# EAGLE board 320349C(Rev1)E7 (EAGLE 7.7.0), part 1 of 3
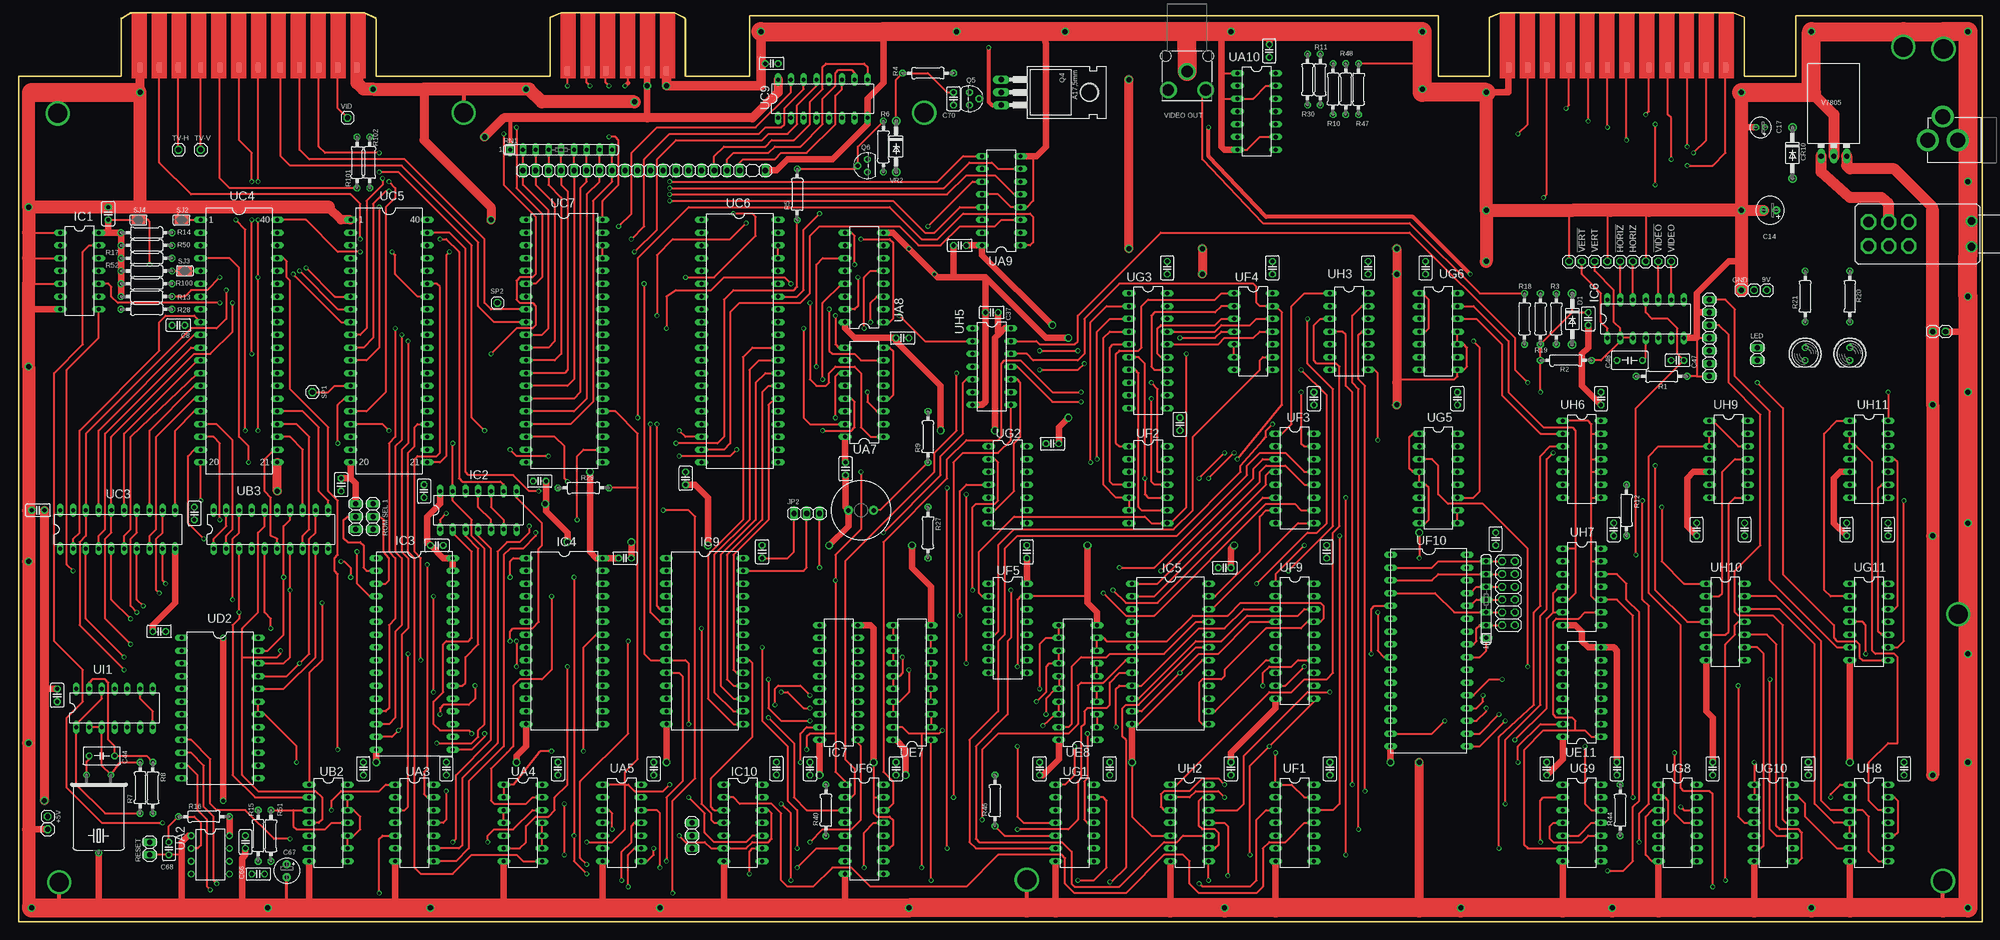
[diagram p9: board, top side]
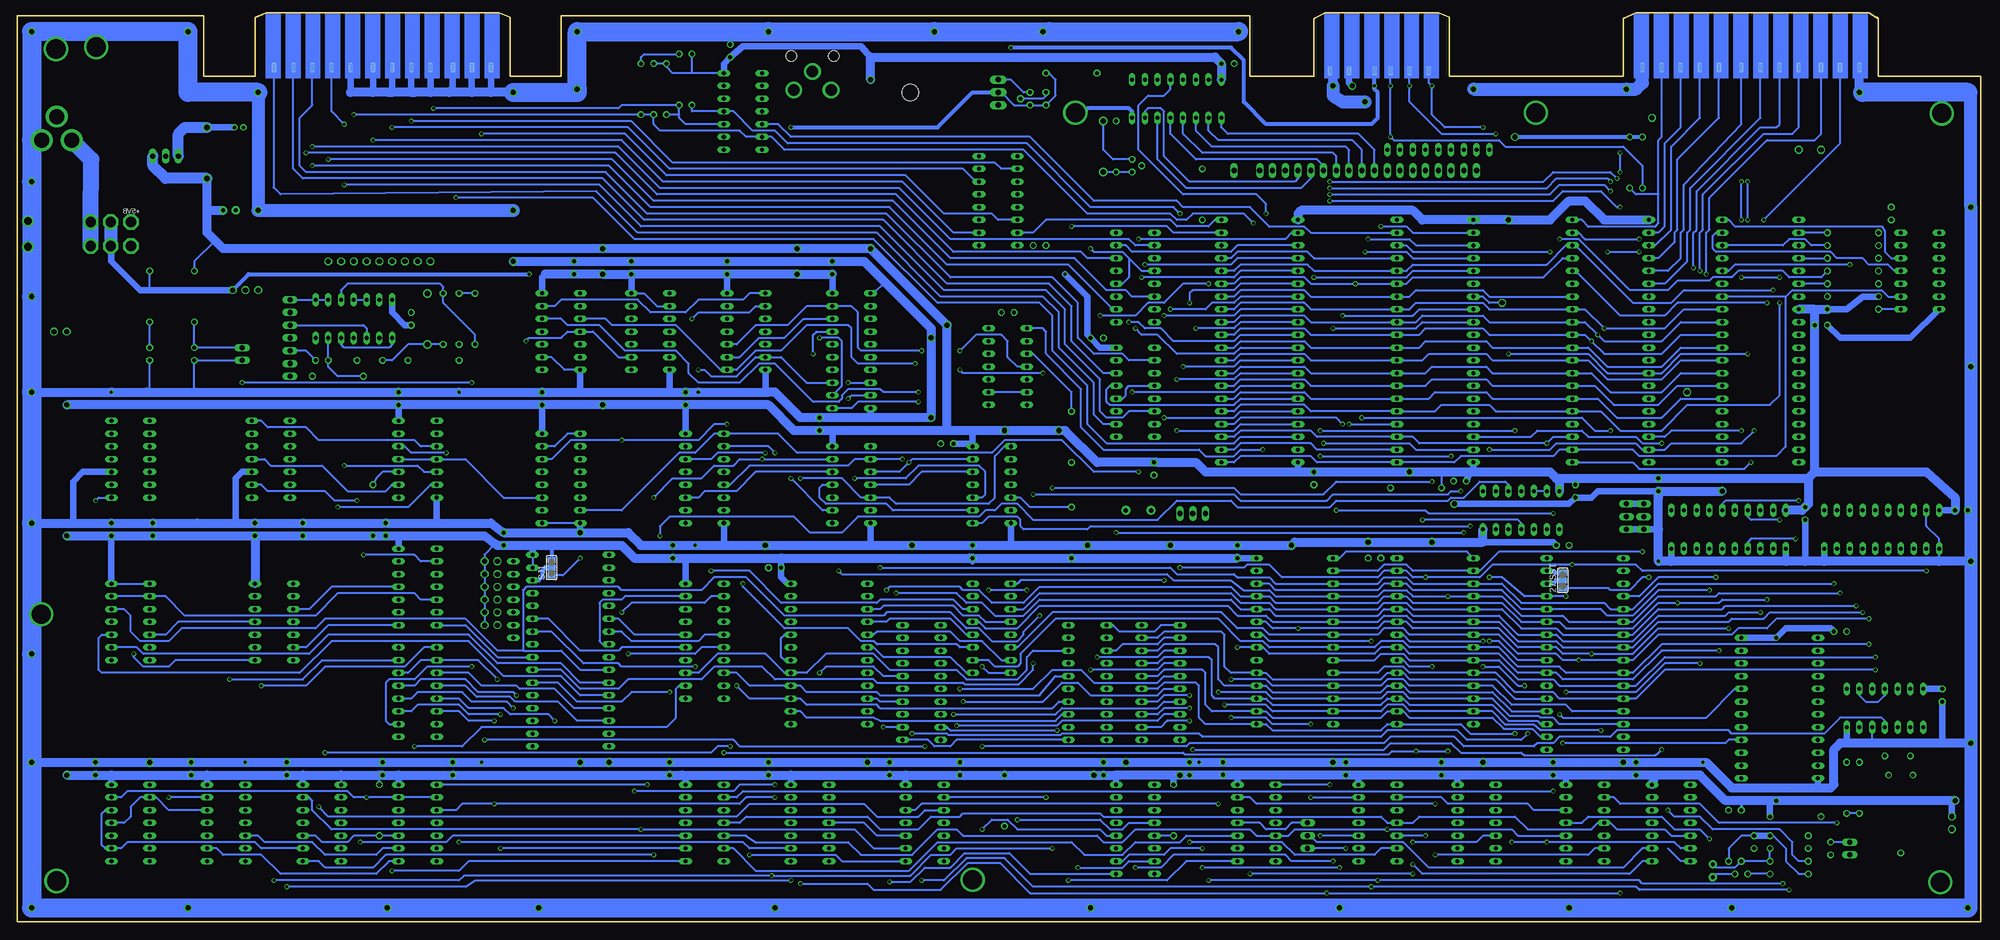
[diagram p10: board, bottom side, seen from below]

Size 390.91 x 180.98 mm. Coordinates in mm from the lower left corner, seen from the top.
Outline: 0,0 0,168.28 20.32,168.28 20.32,179.71 22.23,180.97 68.58,180.97 71.12,179.71 71.12,168.28 105.73,168.28 105.73,180.02 107.95,180.97 130.49,180.97 132.72,179.71 132.72,168.28 145.41,168.28 145.41,180.34 282.57,180.34 282.57,168.28 292.74,168.28 292.74,180.02 294.96,180.97 341.31,180.97 343.54,180.02 343.54,168.28 353.69,168.28 353.69,180.34 390.91,180.34 390.91,0 0,0
Copper layers (1*16): Top 0.035mm / dielectric 1.5mm / Bottom 0.035mm
Design rules "Kens Modified_SeeedStudio_2layer_DRU_no_angle": minimum track width 6mil, minimum drill 12mil, track to track 10mil, track to pad 10mil, pad to pad 10mil, via to via 10mil, smd to smd 0mil, copper to edge 10mil, drill to drill 10mil, minimum pad ring 10mil, minimum via ring 6mil, stop-mask expansion 2mil, vias tented up to drill 100mil, thermal gap 20mil
tKeepout: area 177.6,158.4 to 182.8,163.7; area 85.9,158.4 to 91.1,163.7; area 380.5,171.1 to 385.8,176.4; area 380.4,5.5 to 385.7,10.7; area 198,5.8 to 203.3,11; area 5.4,5.3 to 10.6,10.5; area 5.1,158.3 to 10.4,163.5

## Footprints (pad centres in the part's own frame; a part is rotated, then mirrored left to right if it is on the bottom)
1X01 = drill 1.016 octagon: 1 0,0
SJ_2 = smd 1.168 x 1.6: 1 -1.524,0; 2 0,0; 3 1.524,0
C025-025X050 = drill 0.813 octagon: 1 -1.27,0; 2 1.27,0
E2,5-6 = drill 0.813 pad 1.6: + -1.27,0 | drill 0.813 pad 1.6 octagon: - 1.27,0
E1,8-4 = drill 0.711 pad 1.168: + -0.889,0 | drill 0.711 pad 1.168 octagon: - 0.889,0
C050-035X075 = drill 0.813 octagon: 1 -2.54,0; 2 2.54,0
E2,5-5 = drill 0.813 pad 1.6: + -1.27,0 | drill 0.813 pad 1.6 octagon: - 1.27,0
DO41-10 = drill 1.118: A 5.08,0; C -5.08,0
DIL14 = drill 0.813 long: 1 -7.62,-3.81; 2 -5.08,-3.81; 3 -2.54,-3.81; 4 0,-3.81; 5 2.54,-3.81; 6 5.08,-3.81; 7 7.62,-3.81; 8 7.62,3.81; 9 5.08,3.81; 10 2.54,3.81; 11 0,3.81; 12 -2.54,3.81; 13 -5.08,3.81; 14 -7.62,3.81
SST39SF010A = drill 0.8 long: 1 -7.62,17.78; 2 -7.62,15.24; 3 -7.62,12.7; 4 -7.62,10.16; 5 -7.62,7.62; 6 -7.62,5.08; 7 -7.62,2.54; 8 -7.62,0; 9 -7.62,-2.54; 10 -7.62,-5.08; 11 -7.62,-7.62; 12 -7.62,-10.16; 13 -7.62,-12.7; 14 -7.62,-15.24; 15 -7.62,-17.78; 16 -7.62,-20.32; 17 7.62,-20.32; 18 7.62,-17.78; 19 7.62,-15.24; 20 7.62,-12.7; 21 7.62,-10.16; 22 7.62,-7.62; 23 7.62,-5.08; 24 7.62,-2.54; 25 7.62,0; 26 7.62,2.54; 27 7.62,5.08; 28 7.62,7.62; 29 7.62,10.16; 30 7.62,12.7; 31 7.62,15.24; 32 7.62,17.78
DIL28 = drill 0.813 long: 1 -16.51,-7.62; 2 -13.97,-7.62; 3 -11.43,-7.62; 4 -8.89,-7.62; 5 -6.35,-7.62; 6 -3.81,-7.62; 7 -1.27,-7.62; 8 1.27,-7.62; 9 3.81,-7.62; 10 6.35,-7.62; 11 8.89,-7.62; 12 11.43,-7.62; 13 13.97,-7.62; 14 16.51,-7.62; 15 16.51,7.62; 16 13.97,7.62; 17 11.43,7.62; 18 8.89,7.62; 19 6.35,7.62; 20 3.81,7.62; 21 1.27,7.62; 22 -1.27,7.62; 23 -3.81,7.62; 24 -6.35,7.62; 25 -8.89,7.62; 26 -11.43,7.62; 27 -13.97,7.62; 28 -16.51,7.62
DIL24 = drill 0.813 long: 1 -13.97,-7.62; 2 -11.43,-7.62; 3 -8.89,-7.62; 4 -6.35,-7.62; 5 -3.81,-7.62; 6 -1.27,-7.62; 7 1.27,-7.62; 8 3.81,-7.62; 9 6.35,-7.62; 10 8.89,-7.62; 11 11.43,-7.62; 12 13.97,-7.62; 13 13.97,7.62; 14 11.43,7.62; 15 8.89,7.62; 16 6.35,7.62; 17 3.81,7.62; 18 1.27,7.62; 19 -1.27,7.62; 20 -3.81,7.62; 21 -6.35,7.62; 22 -8.89,7.62; 23 -11.43,7.62; 24 -13.97,7.62
DIL20 = drill 0.813 long: 1 -11.43,-3.81; 2 -8.89,-3.81; 3 -6.35,-3.81; 4 -3.81,-3.81; 5 -1.27,-3.81; 6 1.27,-3.81; 7 3.81,-3.81; 8 6.35,-3.81; 9 8.89,-3.81; 10 11.43,-3.81; 11 11.43,3.81; 12 8.89,3.81; 13 6.35,3.81; 14 3.81,3.81; 15 1.27,3.81; 16 -1.27,3.81; 17 -3.81,3.81; 18 -6.35,3.81; 19 -8.89,3.81; 20 -11.43,3.81
UPS24EDGE = smd 0.965 x 1.93: 1 -21.59,3.81; 2 -17.78,3.81; 3 -13.97,3.81; 4 -10.16,3.81; 5 -6.35,3.81; 6 -1.905,3.81; 7 1.905,3.81; 8 5.715,3.81; 9 9.525,3.81; 10 13.97,3.81; 11 17.78,3.81; 12 21.59,3.81 | smd 0.965 x 1.93 bottom: A -21.59,3.81; B -17.78,3.81; C -13.97,3.81; D -10.16,3.81; E -6.35,3.81; F -1.905,3.81; H 1.905,3.81; J 5.715,3.81; K 9.525,3.81; L 13.97,3.81; M 17.78,3.81; N 21.59,3.81
CASSETTE = smd 0.965 x 1.93: 1 -21.59,4.445; 2 -17.78,4.445; 3 -13.97,4.445; 4 -9.525,4.445; 5 -5.715,4.445; 6 -1.905,4.445 | smd 0.965 x 1.93 bottom: A -22.225,4.445; B -18.415,4.445; C -13.335,4.445; D -10.16,4.445; E -6.35,4.445; F -2.54,4.445
POWER_JACK_PTH = drill 2.997 pad 4.318: GND 0,7.7; GNDBREAK 4.7,10.7; PWR 0,13.7
PET_KEYBOARD = drill 1.016 long: 1 -24.13,0; 2 -21.59,0; 3 -19.05,0; 4 -16.51,0; 5 -13.97,0; 6 -11.43,0; 7 -8.89,0; 8 -6.35,0; 9 -3.81,0; 10 -1.27,0; 11 1.27,0; 12 3.81,0; 13 6.35,0; 14 8.89,0; 15 11.43,0; 16 13.97,0; 17 16.51,0; 18 19.05,0; 20 24.13,0
1X03 = drill 1.016 long: 1 -2.54,0; 2 0,0; 3 2.54,0
1X07 = drill 1.016 long: 1 -7.62,0; 2 -5.08,0; 3 -2.54,0; 4 0,0; 5 2.54,0; 6 5.08,0; 7 7.62,0
2X06 = drill 1.016 octagon: 1 -6.35,-1.27; 2 -6.35,1.27; 3 -3.81,-1.27; 4 -3.81,1.27; 5 -1.27,-1.27; 6 -1.27,1.27; 7 1.27,-1.27; 8 1.27,1.27; 9 3.81,-1.27; 10 3.81,1.27; 11 6.35,-1.27; 12 6.35,1.27
1X02 = drill 1.016 long: 1 -1.27,0; 2 1.27,0
LED5MM = drill 0.813 octagon: A -1.27,0; K 1.27,0
TO220 = drill 1.118 long: 1 -2.54,-6.35; 2 0,-6.35; 3 2.54,-6.35 | hole 3.302: 0,11.176
TO92 = drill 0.813 octagon: 1 1.27,0; 2 0,1.905; 3 -1.27,0
0207/10 = drill 0.813 octagon: 1 -5.08,0; 2 5.08,0
SIL9 = drill 0.813 long: 1 -10.16,0; 2 -7.62,0; 3 -5.08,0; 4 -2.54,0; 5 0,0; 6 2.54,0; 7 5.08,0; 8 7.62,0; 9 10.16,0
SIL7 = drill 0.813 long: 1 -7.62,0; 2 -5.08,0; 3 -2.54,0; 4 0,0; 5 2.54,0; 6 5.08,0; 7 7.62,0
320-938H = drill 2.007 octagon: 1 -4.013,-2.388; 2 0,-2.388; 3 4.013,-2.388; 4 -4.013,2.388; 5 0,2.388; 6 4.013,2.388 | drill 1.5: P$1 16.51,2.54; P$2 16.51,-2.54
BUZZER-12MM = drill 0.9 pad 1.778: + 2.5,0; - -2.5,0
SJ = smd 1.168 x 1.6: 1 -0.762,0; 2 0.762,0
DIL08 = drill 0.813 pad 1.27: 1 -3.81,-3.81; 2 -1.27,-3.81; 3 1.27,-3.81; 4 3.81,-3.81; 5 3.81,3.81; 6 1.27,3.81; 7 -1.27,3.81; 8 -3.81,3.81
DIL16 = drill 0.813 long: 1 -8.89,-3.81; 2 -6.35,-3.81; 3 -3.81,-3.81; 4 -1.27,-3.81; 5 1.27,-3.81; 6 3.81,-3.81; 7 6.35,-3.81; 8 8.89,-3.81; 9 8.89,3.81; 10 6.35,3.81; 11 3.81,3.81; 12 1.27,3.81; 13 -1.27,3.81; 14 -3.81,3.81; 15 -6.35,3.81; 16 -8.89,3.81
DIP40 = drill 0.813 pad 1.27 long: 1 -24.13,-7.62; 2 -21.59,-7.62; 3 -19.05,-7.62; 4 -16.51,-7.62; 5 -13.97,-7.62; 6 -11.43,-7.62; 7 -8.89,-7.62; 8 -6.35,-7.62; 9 -3.81,-7.62; 10 -1.27,-7.62; 11 1.27,-7.62; 12 3.81,-7.62; 13 6.35,-7.62; 14 8.89,-7.62; 15 11.43,-7.62; 16 13.97,-7.62; 17 16.51,-7.62; 18 19.05,-7.62; 19 21.59,-7.62; 20 24.13,-7.62; 21 24.13,7.62; 22 21.59,7.62; 23 19.05,7.62; 24 16.51,7.62; 25 13.97,7.62; 26 11.43,7.62; 27 8.89,7.62; 28 6.35,7.62; 29 3.81,7.62; 30 1.27,7.62; 31 -1.27,7.62; 32 -3.81,7.62; 33 -6.35,7.62; 34 -8.89,7.62; 35 -11.43,7.62; 36 -13.97,7.62; 37 -16.51,7.62; 38 -19.05,7.62; 39 -21.59,7.62; 40 -24.13,7.62
DIL40 = drill 0.813 long: 1 -24.13,-7.62; 2 -21.59,-7.62; 3 -19.05,-7.62; 4 -16.51,-7.62; 5 -13.97,-7.62; 6 -11.43,-7.62; 7 -8.89,-7.62; 8 -6.35,-7.62; 9 -3.81,-7.62; 10 -1.27,-7.62; 11 1.27,-7.62; 12 3.81,-7.62; 13 6.35,-7.62; 14 8.89,-7.62; 15 11.43,-7.62; 16 13.97,-7.62; 17 16.51,-7.62; 18 19.05,-7.62; 19 21.59,-7.62; 20 24.13,-7.62; 21 24.13,7.62; 22 21.59,7.62; 23 19.05,7.62; 24 16.51,7.62; 25 13.97,7.62; 26 11.43,7.62; 27 8.89,7.62; 28 6.35,7.62; 29 3.81,7.62; 30 1.27,7.62; 31 -1.27,7.62; 32 -3.81,7.62; 33 -6.35,7.62; 34 -8.89,7.62; 35 -11.43,7.62; 36 -13.97,7.62; 37 -16.51,7.62; 38 -19.05,7.62; 39 -21.59,7.62; 40 -24.13,7.62
DIL24-6 = drill 0.813 long: 1 -13.97,-7.62; 2 -11.43,-7.62; 3 -8.89,-7.62; 4 -6.35,-7.62; 5 -3.81,-7.62; 6 -1.27,-7.62; 7 1.27,-7.62; 8 3.81,-7.62; 9 6.35,-7.62; 10 8.89,-7.62; 11 11.43,-7.62; 12 13.97,-7.62; 13 13.97,7.62; 14 11.43,7.62; 15 8.89,7.62; 16 6.35,7.62; 17 3.81,7.62; 18 1.27,7.62; 19 -1.27,7.62; 20 -3.81,7.62; 21 -6.35,7.62; 22 -8.89,7.62; 23 -11.43,7.62; 24 -13.97,7.62
VREG_78XXL = drill 1.016 long: GND 0,-3.81; IN -2.54,-3.81; OUT 2.54,-3.81
RCA = drill 2.3: BARREL 0,0; BREAK 3.7,3.7; SPRING 3.7,-3.7 | hole 2.1: -3.1,4.25; -3.1,-4.25
DO41Z10 = drill 1.118: A 5.08,0; C -5.08,0
HC49TL-H = drill 0.813: 1 -2.413,-7.62; 2 2.413,-7.62; 3 0,7.874

## Placement (x,y rotation side)
9V  [1X01]  347.98,125.73 180 top
27/SST  27/SST  [SJ_2]  83.19,67.94 90 bottom
!HORIZ  [1X01]  318.77,131.44 90 top
!VERT  [1X01]  311.15,131.44 90 top
!VIDEO  [1X01]  326.39,131.44 90 top
+5V  [1X01]  5.71,20.95 0 top
+5V1  +5V  [1X01]  381,117.47 0 top
C1  0.1uF/50  [C025-025X050]  103.65,87.73 0 top
C2  0.1uF/50  [C025-025X050]  68.58,30.48 90 top
C3  0.1uF/50  [C025-025X050]  85.09,30.48 90 top
C4  0.1uF/50  [C025-025X050]  107.31,30.48 90 top
C5  0.1uF/50  [C025-025X050]  126.36,30.48 90 top
C6  0.1uF/50  [C025-025X050]  45.09,15.88 270 top
C7  0.1uF/50  [C025-025X050]  3.81,81.92 180 top
C8  0.1uF/50  [C025-025X050]  31.75,118.75 180 top
C9  0.1uF/50  [C025-025X050]  64.14,87 270 top
C10  0.1uF/50  [C025-025X050]  314.96,104.14 90 top
C11  0.1uF/50  [C025-025X050]  203.2,30.48 90 top
C12  0.1uF/50  [C025-025X050]  231.14,99.06 90 top
C13  0.1uF/50  [C025-025X050]  372.11,78.11 90 top
C14  47uF/16  [E2,5-6]  348.62,141.6 180 top
C17  1.0uF/25  [E1,8-4]  346.71,158.12 180 top
C18  0.1uF/50  [C025-025X050]  240.03,70.48 0 top
C19  0.1uF/50  [C025-025X050]  205.74,95.17 0 top
C20  0.1uF/50  [C025-025X050]  280.04,130.18 90 top
C21  0.1uF/50  [C025-025X050]  260.99,30.48 90 top
C22  0.1uF/50  [C025-025X050]  83.19,74.93 0 top
C23  0.1uF/50  [C025-025X050]  174.62,30.48 90 top
C24  0.1uF/50  [C025-025X050]  334.01,78.11 90 top
C25  0.1uF/50  [C025-025X050]  217.17,30.48 90 top
C26  0.1uF/50  [C025-025X050]  257.81,104.14 90 top
C27  0.1uF/50  [C025-025X050]  241.3,30.48 90 top
C28  0.1uF/50  [C025-025X050]  157.48,30.48 90 top
C29  0.1uF/50  [C025-025X050]  318.13,30.48 90 top
C30  0.1uF/50  [C025-025X050]  294,76.2 90 top
C31  0.1uF/50  [C025-025X050]  147.96,73.66 90 top
C32  0.1uF/50  [C025-025X050]  260.35,73.66 90 top
C33  0.1uF/50  [C025-025X050]  343.54,78.11 90 top
C34  0.1uF/50  [C025-025X050]  120.65,72.39 0 top
C35  0.1uF/50  [C025-025X050]  363.86,78.11 90 top
C36  0.1uF/50  [C025-025X050]  337.19,30.48 90 top
C37  0.1uF/50  [C025-025X050]  193.68,121.28 180 top
C38  0.1uF/50  [C025-025X050]  150.81,30.52 90 top
C39  0.1uF/50  [C025-025X050]  249.56,130.18 90 top
C40  0.1uF/50  [C025-025X050]  375.29,30.48 90 top
C41  0.1uF/50  [C025-025X050]  228.6,130.18 90 top
C42  0.1uF/50  [C025-025X050]  200.66,73.66 90 top
C44  22pF  [C050-035X075]  16.51,33.02 180 top
C45  0.1uF/50  [C025-025X050]  268.61,130.18 90 top
C46  0.1uF/50  [C025-025X050]  286.38,104.14 90 top
C47  2200pF  [C025-025X050]  330.2,111.76 180 top
C48  47uF  [C050-035X075]  320.68,111.76 180 top
C49  0.1uF/50  [C025-025X050]  312.42,120.02 90 top
C50  0.1uF/50  [C025-025X050]  356.24,30.48 90 top
C51  0.1uF/50  [C025-025X050]  80.64,85.72 270 top
C52  0.1uF/50  [C025-025X050]  175.9,116.2 0 top
C53  0.1uF/50  [C025-025X050]  27.94,57.78 180 top
C54  0.1uF/50  [C025-025X050]  149.86,170.81 180 top
C55  0.1uF/50  [C025-025X050]  248.92,173.35 90 top
C56  0.1uF/50  [C025-025X050]  187.32,134.62 180 top
C66  0.01uF  [C025-025X050]  47.62,9.53 0 top
C67  1.0uF/25  [E2,5-5]  53.34,10.16 270 top
C68  0.1uF/50  [C025-025X050]  29.84,14.61 270 top
C70  0.01uF  [C025-025X050]  186.06,163.83 90 top
C77  0.1uF/50  [C025-025X050]  17.78,140.97 90 top
C78  0.1uF/50  [C025-025X050]  132.72,88.27 270 top
C79  0.1uF/50  [C025-025X050]  34.92,81.28 270 top
C80  0.1uF/50  [C025-025X050]  7.62,45.09 270 top
C91  0.1uF/50  [C025-025X050]  317.5,78.11 90 top
C92  0.1uF/50  [C025-025X050]  304.17,30.48 90 top
C93  0.1uF/50  [C025-025X050]  164.55,90.18 270 top
CR10  1N4001  [DO41-10]  353.06,153.03 270 top
D1  1N4001  [DO41-10]  309.25,120.02 270 top
GND2  GND  [1X01]  342.9,125.73 0 top
GND3  GND  [1X01]  383.54,117.47 0 top
GND4  GND  [1X01]  5.71,18.41 90 top
HGND  GND  [1X01]  316.23,131.44 90 top
HORIZ  [1X01]  321.31,131.44 90 top
IC1  7417  [DIL14]  12.06,129.54 270 top
IC2  7400  [DIL14]  91.44,81.92 0 top
IC3  SST39SF010A / 27512  [SST39SF010A]  78.74,54.61 0 top
IC4  62256  [DIL28]  108.58,55.88 270 top
IC5  6116  [DIL24]  229.24,53.34 270 top
IC6  74LS02N  [DIL14]  323.85,120.02 0 top
IC7  74LS645N  [DIL20]  163.19,47.62 90 top
IC9  62256  [DIL28]  136.53,55.88 270 top
IC10  74LS00N  [DIL14]  144.15,19.68 270 top
J1  IEEE-488 INTERFACE  [UPS24EDGE]  318.13,173.85 180 top
J2  USER PORT  [UPS24EDGE]  45.72,173.85 180 top
J3  CASSETTE #1  [CASSETTE]  107.31,173.85 180 top
J4  POWER_JACKPTH  [POWER_JACK_PTH]  393.7,155.57 90 top
J5  KEYBOARD SCAN  [PET_KEYBOARD]  124.46,149.54 0 top
JP1  ROM SEL 1  [1X03]  70.48,80.64 270 top
JP2  RO / RW SELECT  [1X03]  156.84,81.28 0 top
JP3  9A / 9F SELECT  [1X03]  133.99,17.14 270 top
JP4  VIDEO  [1X07]  336.55,116.2 270 top
JP5  ROM SEL 2  [1X03]  67.06,80.64 270 top
JP6  FONT SEL  [2X06]  296.55,65.41 90 top
KEY  Key  [1X01]  345.44,125.73 0 top
LED  [1X02]  346.07,113.03 270 top
LED1  +9V  [LED5MM]  364.49,113.03 270 top
LED2  +5V  [LED5MM]  355.6,113.03 270 top
Q4  TIP29  [TO220]  201.93,165.1 270 top
Q5  2N4401  [TO92]  189.23,163.83 270 top
Q6  2N3904  [TO92]  168.91,150.5 90 top
R1  1.5k  [0207/10]  327.02,108.58 180 top
R2  1.5k  [0207/10]  307.98,111.76 0 top
R3  470  [0207/10]  306.07,120.02 270 top
R4  1.5K  [0207/10]  180.97,168.91 0 top
R5  1K  [0207/10]  154.94,144.78 90 top
R6  10K  [0207/10]  172.09,154.31 270 top
R7  470  [0207/10]  24.13,26.67 90 top
R8  470  [0207/10]  26.67,26.67 270 top
R9  10  [0207/10]  180.97,96.52 90 top
R10  2.4K  [0207/10]  261.62,165.74 90 top
R11  5.1K  [0207/10]  259.08,167.64 270 top
R12  1K  [0207/10]  320.04,81.92 270 top
R13  1K  [0207/10]  25.4,127 180 top
R14  1K  [0207/10]  25.4,137.16 180 top
R15  1M  [0207/10]  47.62,17.14 90 top
R16  1M  [0207/10]  36.83,20.95 0 top
R17  3.3K  [0207/10]  25.4,132.08 180 top
R18  220  [0207/10]  299.72,120.02 270 top
R19  390  [0207/10]  302.89,120.02 270 top
R20  470  [0207/10]  364.49,124.46 90 top
R21  220  [0207/10]  355.6,124.46 90 top
R27  1K  [0207/10]  180.97,77.47 270 top
R28  470  [0207/10]  25.4,121.92 180 top
R29  470  [0207/10]  112.39,86.36 0 top
R30  470  [0207/10]  256.54,167.64 90 top
R40  1K  [0207/10]  160.66,22.23 90 top
R44  1K  [0207/10]  318.77,22.23 90 top
R46  1K  [0207/10]  194.31,24.13 90 top
R47  5.1K  [0207/10]  266.7,165.74 270 top
R48  2.4K  [0207/10]  264.16,165.74 90 top
R50  1K  [0207/10]  25.4,134.62 180 top
R51  1K  [0207/10]  50.16,17.14 270 top
R52  470  [0207/10]  25.4,129.54 180 top
R100  47K  [0207/10]  25.4,124.46 0 top
R101  47K  [0207/10]  67.31,151.13 270 top
R102  47K  [0207/10]  69.85,151.13 90 top
RESET  [1X02]  26.04,14.61 90 top
RN1  10K  [SIL9]  107.95,153.67 0 top
RN2  10K  [SIL7]  292.1,64.14 90 top
S1  [320-938H]  372.24,136.91 0 top
SG1  BUZZER  [BUZZER-12MM]  167.64,81.92 0 top
SJ1  27/SST  [SJ_2]  284.48,70.48 90 bottom
SJ2  [SJ]  32.38,139.7 0 top
SJ3  [SJ]  33.02,129.54 180 top
SJ4  [SJ]  23.81,139.7 0 top
SP1  [1X01]  58.42,105.41 270 top
SP2  [1X01]  95.25,123.19 0 top
TV-H  [1X01]  31.75,153.67 0 top
TV-V  [1X01]  36.2,153.67 0 top
U$32  CBM-XL  [CBM-XL]  268.61,145.41 0 top
UA2  555  [DIL08]  38.1,13.34 270 top
UA3  74LS04  [DIL14]  78.74,19.68 270 top
UA4  74LS00  [DIL14]  100.33,19.68 270 top
UA5  74LS10  [DIL14]  120.02,19.68 270 top
UA7  MC3446  [DIL16]  168.28,105.41 90 top
UA8  MC3446  [DIL16]  168.28,128.27 90 top
UA9  MC3446  [DIL16]  195.58,143.51 90 top
UA10  7417  [DIL14]  246.38,161.29 270 top
UB2  7425  [DIL14]  61.59,19.68 270 top
UB3  74LS244  [DIL20]  50.16,78.11 0 top
UC3  74LS244  [DIL20]  19.68,78.11 0 top
UC4  6502  [DIP40]  43.81,115.57 270 top
UC5  6522  [DIP40]  73.66,115.57 270 top
UC6  6520  [DIL40]  143.51,115.57 270 top
UC7  6520  [DIL40]  108.58,115.57 270 top
UC9  74LS145  [DIL16]  160.02,163.83 0 top
UD2  74154  [DIL24-6]  40.01,42.55 270 top
UE7  74LS244N  [DIL20]  177.8,47.62 90 top
UE8  74LS244N  [DIL20]  210.82,47.62 90 top
UE11  74LS165  [DIL16]  311.15,45.72 90 top
UF1  74LS08  [DIL14]  254,19.68 270 top
UF2  74177  [DIL14]  224.79,87 270 top
UF3  74LS157  [DIL16]  254,88.27 270 top
UF4  74177  [DIL14]  245.75,117.47 270 top
UF5  74LS157  [DIL16]  196.85,58.42 270 top
UF6  74LS157  [DIL16]  168.28,18.41 270 top
UF9  74LS373  [DIL20]  254,55.88 270 top
UF10  SST39SF010A / 27xxx  [SST39SF010A]  280.67,55.24 0 top
UG1  74LS08  [DIL14]  210.19,19.68 270 top
UG2  74LS20  [DIL14]  196.85,87 270 top
UG3  74LS373  [DIL20]  224.79,113.67 270 top
UG5  74191  [DIL16]  282.57,88.27 270 top
UG6  74LS107  [DIL14]  282.57,117.47 270 top
UG8  74S74  [DIL14]  330.2,19.68 270 top
UG9  74LS74  [DIL14]  311.15,19.68 270 top
UG10  7400  [DIL14]  349.25,19.68 270 top
UG11  74LS20  [DIL14]  368.3,59.69 270 top
UH2  74S04  [DIL14]  233.04,19.68 270 top
UH3  74LS164  [DIL14]  264.8,117.47 270 top
UH5  74LS00  [DIL14]  193.68,110.49 270 top
UH6  74LS107  [DIL14]  311.15,92.08 270 top
UH7  74LS107  [DIL14]  311.15,66.67 270 top
UH8  74LS107  [DIL14]  368.3,19.68 270 top
UH9  74LS93  [DIL14]  340.36,92.08 270 top
UH10  74LS08  [DIL14]  339.73,59.69 270 top
UH11  74LS93  [DIL14]  368.3,92.08 270 top
UI1  74S04  [DIL14]  19.05,42.55 0 top
V7805  [VREG_78XXL]  361.31,156.21 0 top
VDGND  GND  [1X01]  323.85,131.44 90 top
VERT  [1X01]  313.69,131.44 0 top
VGND  GND  [1X01]  308.61,131.44 90 top
VID  [1X01]  65.41,160.02 0 top
VIDEO  [1X01]  328.93,131.44 0 top
VIDEO_OUT  POWER_JACKRCA  [RCA]  232.54,169.25 270 top
VR2  7.5V  [DO41Z10]  174.62,154.31 270 top
Y1  16MHz  [HC49TL-H]  15.88,21.59 180 top

## Tracks (layer width: path | path; a pad name or v marks a point on that pad's centre or on a via)
9000-FFFF  (via drill 0.6)
  Top 0.406: v128.27,81.92 133.35,81.92 134.62,80.64 134.62,28.57 130.18,24.13 v130.18,5.71 | v85.09,81.28 83.82,80.01 IC2.1 | UF1.3 248.28,22.23 246.38,20.32 246.38,8.26 245.11,6.99 235.59,6.99 v234.95,7.62 | v71.75,5.71 71.75,16.51 72.39,17.14 UA3.5
  Bottom 0.406: v128.27,81.92 110.49,81.92 109.86,81.28 v85.09,81.28 | v234.95,7.62 221.62,7.62 220.34,6.35 207.01,6.35 201.61,11.75 195.26,11.75 189.23,5.71 v130.18,5.71 v71.75,5.71
!20_LINES
  Top 0.406: UH5.10 198.75,107.95 199.39,107.31 199.39,96.52 198.12,95.25 198.12,85.72 194.31,81.92 UG2.6
!200_LINES
  Bottom 0.406: UH5.6 UH5.9
!8800-8FFF  (via drill 0.6)
  Top 0.406: IC10.12 149.22,22.23 149.86,21.59 149.86,16.51 149.22,15.88 146.05,15.88 144.78,14.61 IC10.6 137.79,14.61 136.53,15.88 132.72,15.88 v131.44,17.14
  Bottom 0.406: UA5.10 v131.44,17.14
!9000-FFFF  (via drill 0.6)
  Top 0.406: v108.58,13.34 v108.58,23.5
  Bottom 0.406: v108.58,23.5 144.15,23.5 145.41,24.77 IC10.13 | UA3.6 76.83,14.61 78.11,13.34 v108.58,13.34
!ATN  (via drill 0.6)
  Top 0.406: J1.11 300.36,158.75 v298.45,156.84
  Bottom 0.406: UA9.14 195.58,139.7 196.85,140.97 206.38,140.97 214,148.59 261.62,148.59 269.88,156.84 v298.45,156.84
!ATN_IN
  Bottom 0.406: UC6.40 152.4,139.7 153.67,138.43 160.02,138.43 161.29,139.7 186.06,139.7 188.59,137.16 UA9.15
!ATN_OUT  (via drill 0.6)
  Top 0.406: UA9.13 187.32,142.24 182.25,137.16 180.34,137.16 173.99,143.51 v129.54,143.51 | v71.75,142.24 71.75,114.3 69.22,111.76 UC5.12
  Bottom 0.406: v129.54,143.51 85.09,143.51 83.19,145.41 75.56,145.41 72.39,142.24 v71.75,142.24
!B02A  (via drill 0.6)
  Top 0.406: UH2.2 233.04,24.77 234.31,26.04 238.76,26.04 v240.03,24.77 | v305.44,93.34 304.17,92.08 304.17,62.23 302.89,60.96 302.89,43.18 295.91,36.2 v295.91,23.5
  Bottom 0.406: v240.03,24.77 245.75,24.77 247.01,23.5 v295.91,23.5 302.26,23.5 303.53,22.23 UG9.3 | UH6.12 313.69,94.61 312.42,93.34 v305.44,93.34
!B02F
  Bottom 0.406: UG1.10 219.71,17.14 222.25,19.68 UH2.4
!B_R/W
  Bottom 0.406: UA3.12 88.9,22.23 90.17,23.5 106.05,23.5 107.31,24.77 UA5.2
!BA11
  Bottom 0.406: UF1.4 247.01,19.68 245.75,20.95 221.62,20.95 219.07,18.41 211.46,18.41 208.91,20.95 203.2,20.95 202.56,21.59 175.26,21.59 174.62,20.95 119.38,20.95 118.11,19.68 UA5.4 113.03,19.68 111.76,20.95 92.71,20.95 90.17,18.41 77.47,18.41 76.2,19.68 UA3.4 73.66,19.68 72.39,18.41 62.87,18.41 61.59,17.14 UB2.5
!DAV  (via drill 0.6)
  Top 0.406: v320.04,155.57 J1.6
  Bottom 0.406: UA9.2 204.47,137.16 214.63,147.32 262.25,147.32 270.51,155.57 v320.04,155.57
!DAV_IN  (via drill 0.6)
  Top 0.406: UA9.1 201.29,134.62 201.93,135.25 201.93,140.34 201.29,140.97 187.96,140.97 182.88,135.89 179.71,135.89 173.35,142.24 133.35,142.24 123.19,132.08 v123.19,100.33 | UC5.17 72.39,99.06 v73.66,97.79
  Bottom 0.406: v123.19,100.33 79.38,100.33 76.83,97.79 v73.66,97.79
!DAV_OUT
  Top 0.406: UA9.3 195.58,139.7 194.31,138.43 187.32,138.43 183.51,134.62 179.07,134.62 175.26,138.43 159.38,138.43 157.48,136.53 157.48,125.09 155.57,123.19 143.51,123.19 141.6,121.28 141.6,95.25 140.34,93.98 UC6.19
!EOI_IN  (via drill 0.6)
  Top 0.406: v144.78,139.06 141.6,135.89 130.18,135.89 127,132.72 v127,120.65 | J2.4 55.88,153.67 57.78,151.76 76.83,151.76 92.71,135.89 92.71,123.19 93.98,121.92 UC7.8 | J1.5 324.49,161.29 v323.85,160.66
  Bottom 0.406: v144.78,139.06 146.69,140.97 156.84,140.97 158.12,139.7 160.02,139.7 161.29,140.97 177.8,140.97 190.5,153.67 238.12,153.67 240.66,156.21 UA10.6 245.75,156.21 247.01,157.48 262.89,157.48 264.16,158.75 R48.1 R47.2 v323.85,160.66 | UC7.8 111.76,121.92 113.03,120.65 v127,120.65
!EOI_OUT
  Bottom 0.406: UA10.5 239.4,158.75 236.85,156.21 189.23,156.21 176.53,143.51 160.02,143.51 158.75,142.24 145.41,142.24 141.6,138.3 134.62,138.3 133.35,137.16 UC7.39
!IFC  (via drill 0.6)
  Top 0.406: J1.9 308.61,162.56 v307.98,161.93
  Bottom 0.406: UA10.10 257.81,158.75 259.08,160.02 259.08,160.66 | 259.08,160.66 R11.2 270.51,162.56 271.14,161.93 v307.98,161.93 | 259.08,160.66 R10.1
!INIT  (via drill 0.6)
  Top 0.406: v302.89,15.88 302.89,24.13 303.53,24.77 UG9.2 | v321.31,24.77 321.31,60.96 318.13,64.14 UH7.10 313.69,64.14 313.06,64.77 313.06,71.75 | 313.06,71.75 UH7.13 | 313.06,71.75 313.06,84.45 | 313.06,84.45 UH6.8 | 313.06,84.45 313.06,89.53 | 313.06,89.53 313.06,92.08 | 313.06,92.08 UH6.11 | 313.06,89.53 UH6.10 | 313.06,92.08 313.06,97.16 | 313.06,97.16 313.06,99.06 312.42,99.69 UH6.1 | UH8.13 373.38,24.77 374.01,24.13 374.01,17.78 373.38,17.14 UH8.10 | 313.06,97.16 UH6.13 | UG5.11 289.56,84.45 290.83,85.72 290.83,114.3 v289.56,115.57 | UG6.1 279.4,125.09 280.67,123.83 280.67,118.11 280.04,117.47 UG6.4 | UH2.9 238.12,14.61 238.76,15.24 238.76,17.78 238.12,18.41 235.59,18.41 234.95,19.05 234.95,24.13 235.59,24.77 UH2.13
  Bottom 0.406: UH2.9 245.11,14.61 246.38,15.88 v302.89,15.88 | UG9.2 UG9.13 v321.31,24.77 323.85,24.77 325.12,26.04 368.94,26.04 370.2,24.77 UH8.13 | UG5.11 294,84.45 301.62,92.08 UH6.4 UH6.11 | UH6.10 318.13,89.53 319.4,88.27 R12.1 | UH3.9 271.14,112.39 276.23,117.47 UG6.4 281.31,117.47 282.57,116.2 288.93,116.2 v289.56,115.57
!IRQ  (via drill 0.6)
  Top 0.406: UC6.37 UC6.38 | UC4.4 41.91,132.08 43.81,130.18 43.81,96.52 45.72,94.61 v45.72,91.44 | UC5.21 83.82,91.44 85.09,92.71 85.09,132.72 v85.72,133.35 | UC7.37 UC7.38
  Bottom 0.406: UC5.21 69.22,91.44 67.94,90.17 46.99,90.17 v45.72,91.44 | v85.72,133.35 113.03,133.35 114.3,134.62 UC7.38 | UC4.4 R17.1 | UC7.37 132.72,132.08 133.99,133.35 147.96,133.35 149.22,132.08 UC6.37
!LOAD_SR
  Top 0.406: UG9.6 300.36,14.61 299.72,15.24 299.72,34.29 303.53,38.1 309.88,38.1 | 309.88,38.1 311.79,38.1 313.06,36.83 UE11.1 | UH7.9 311.79,61.59 310.51,60.33 306.07,60.33 305.44,59.69 305.44,41.27 306.07,40.64 309.25,40.64 309.88,40.01 309.88,38.1
!NDAC  (via drill 0.6)
  Top 0.406: v312.42,159.38 J1.8
  Bottom 0.406: UA9.10 194.94,149.86 196.22,151.13 260.35,151.13 268.61,159.38 v312.42,159.38
!NDAC_IN  (via drill 0.6)
  Top 0.406: UA9.9 187.96,152.4 182.88,147.32 v129.54,147.32 | v72.39,147.96 72.39,146.69 69.22,143.51 69.22,118.11 67.94,116.84 UC5.10
  Bottom 0.406: v129.54,147.32 87,147.32 85.09,149.22 73.66,149.22 v72.39,147.96
!NDAC_OUT  (via drill 0.6)
  Top 0.406: v180.97,138.43 189.87,147.32 UA9.11
  Bottom 0.406: UC6.39 160.66,137.16 161.93,138.43 v180.97,138.43
!NEXT  (via drill 0.6)
  Top 0.406: v242.57,92.08 251.46,102.87 251.46,121.28 250.19,122.56 UF4.13 247.01,122.56 246.38,123.19 246.38,126.36 245.75,127 219.07,127 212.09,120.02 212.09,113.03 210.82,111.76 201.93,111.76 200.66,113.03 UH5.12 | v264.16,13.34 v264.16,84.45
  Bottom 0.406: UG8.8 330.83,12.06 329.56,10.79 320.04,10.79 317.5,13.34 v264.16,13.34 | UF2.13 v242.57,92.08 247.01,92.08 248.28,90.81 252.09,90.81 254.63,88.27 260.35,88.27 v264.16,84.45
!NMI
  Bottom 0.406: R13.1 UC4.6
!NO_ROM  (via drill 0.6)
  Top 0.406: v83.82,135.89 85.09,135.89 87.63,133.35 87.63,88.27 88.27,87.63 95.89,87.63 96.52,87 IC2.9 | R52.1 SJ3.2
  Bottom 0.406: v83.82,135.89 80.01,135.89 69.85,125.73 62.23,125.73 60.33,127.64 53.98,127.64 53.34,128.27 49.53,128.27 48.26,129.54 39.37,129.54 38.1,128.27 31.75,128.27 R52.1
!NRFD  (via drill 0.6)
  Top 0.406: v316.23,158.12 J1.7
  Bottom 0.406: UA9.6 200.03,147.32 202.56,149.86 260.99,149.86 269.24,158.12 v316.23,158.12
!NRFD_IN  (via drill 0.6)
  Top 0.406: UA9.7 194.94,149.86 193.68,151.13 189.23,151.13 184.15,146.05 v129.54,146.05 | v73.66,147.32 74.93,146.05 74.93,144.15 73.03,142.24 73.03,105.41 69.22,101.6 UC5.16
  Bottom 0.406: v129.54,146.05 86.36,146.05 84.45,147.96 74.3,147.96 v73.66,147.32
!NRFD_OUT  (via drill 0.6)
  Top 0.406: UA9.5 198.12,144.78 194.31,148.59 188.59,148.59 184.78,144.78 v129.54,144.78 | v73.66,145.41 73.03,145.41 70.48,142.88 70.48,116.2 68.58,114.3 UC5.11
  Bottom 0.406: v129.54,144.78 85.72,144.78 83.82,146.69 74.93,146.69 v73.66,145.41
!RA1  (via drill 0.6)
  Top 0.406: UG6.12 290.19,120.02 295.27,114.94 295.27,104.78 302.89,97.16 UH6.2 | UF6.14 172.72,22.23 173.99,23.5 173.99,27.94 172.09,29.84 172.09,75.56 184.78,88.27 184.78,92.08 188.59,95.89 194.94,95.89 195.58,96.52 195.58,111.12 196.22,111.76 199.39,111.76 205.74,105.41 v211.46,105.41
  Bottom 0.406: v211.46,105.41 218.44,105.41 219.07,106.05 225.43,106.05 226.69,104.78 226.69,104.14 227.33,103.5 232.41,103.5 240.03,111.12 243.21,111.12 247.01,107.31 255.27,107.31 257.18,109.22 257.18,111.12 259.71,113.67 269.88,113.67 274.95,118.75 281.31,118.75 282.57,120.02 UG6.12
!RELOAD  (via drill 0.6)
  Top 0.406: UH5.13 202.56,115.57 203.2,114.94 210.19,114.94 210.82,115.57 210.82,120.65 227.33,137.16 276.86,137.16 297.81,116.2 297.81,109.86 v300.36,107.31 | v346.07,107.31 351.15,102.23 351.15,69.22 361.31,59.05 361.31,56.52 361.95,55.88 365.76,55.88 366.39,55.24 366.39,52.7 367.03,52.07 UG11.8
  Bottom 0.406: v300.36,107.31 v346.07,107.31
!RES  (via drill 0.6)
  Top 0.406: v159.38,140.97 156.21,137.79 156.21,125.73 154.94,124.46 UC6.34 | UC4.40 57.15,139.7 63.5,133.35 v67.94,133.35 | UC5.34 79.38,124.46 74.93,128.91 74.93,132.72 v74.3,133.35
  Bottom 0.406: UC5.34 97.79,124.46 99.06,125.73 112.39,125.73 113.67,124.46 UC7.34 133.35,124.46 134.62,125.73 147.32,125.73 148.59,124.46 UC6.34 | v159.38,140.97 160.66,142.24 177.16,142.24 189.87,154.94 237.49,154.94 240.03,157.48 244.47,157.48 248.28,161.29 UA10.11 256.54,161.29 R30.1 | UC4.40 50.16,139.7 48.9,138.43 19.68,138.43 19.05,137.48 19.05,133.35 17.78,132.08 IC1.12 | v74.3,133.35 v67.94,133.35
!SEL8  (via drill 0.6)
  Top 0.406: UD2.9 34.29,36.2 38.1,32.38 38.1,23.5 39.37,22.23 45.09,22.23 50.8,16.51 v53.98,16.51 | v85.09,26.04 85.09,20.32 84.45,19.68 UA3.11
  Bottom 0.406: UF1.2 247.65,24.77 246.38,26.04 v85.09,26.04 | UA3.11 79.38,19.68 78.11,20.95 63.5,20.95 60.96,18.41 55.88,18.41 v53.98,16.51
!SEL9  (via drill 0.6)
  Top 0.406: UD2.10 34.29,33.66 36.83,31.11 36.83,22.86 38.73,20.95 38.73,8.26 v39.37,7.62 | v153.67,8.26 153.67,21.59 v151.76,23.5 | UA5.11 122.56,19.68 121.92,19.05 121.92,15.88 120.02,13.97 v120.02,8.26
  Bottom 0.406: v39.37,7.62 67.31,7.62 67.94,8.26 v120.02,8.26 v153.67,8.26 | UG1.12 212.09,22.23 210.82,23.5 v151.76,23.5
!SEL_B000-FFFF
  Top 0.406: IC2.3 88.9,76.83 91.44,74.3 91.44,55.24 88.9,52.7 88.9,47.62 88.27,46.99 IC3.22
!SEL_E8XX  (via drill 0.6)
  Top 0.406: IC2.6 96.52,80.01 93.98,82.55 IC2.10 | UF1.12 261.62,22.23 262.89,23.5 v262.89,76.83
  Bottom 0.406: IC2.10 93.98,87 94.61,87.63 99.69,87.63 102.87,84.45 105.41,84.45 106.05,83.82 128.27,83.82 129.54,82.55 147.96,82.55 149.22,83.82 160.02,83.82 163.83,80.01 188.59,80.01 191.77,83.19 194.94,83.19 196.22,81.92 198.12,81.92 199.39,80.64 223.52,80.64 226.69,77.47 233.04,77.47 236.22,80.64 260.99,80.64 262.89,78.74 v262.89,76.83
!SELA  (via drill 0.6)
  Top 0.406: UD2.11 33.66,31.11 35.56,29.21 35.56,22.23 37.47,20.32 37.47,6.99 v38.1,6.35 | UA5.9 122.56,14.61 121.28,13.34 v121.28,6.99 | UG1.13 215.9,24.77 216.53,24.13 216.53,10.79 214,8.26 v210.82,8.26
  Bottom 0.406: v38.1,6.35 67.94,6.35 68.58,6.99 v121.28,6.99 188.59,6.99 194.31,12.7 201.93,12.7 206.38,8.26 v210.82,8.26
!SELE  (via drill 0.6)
  Top 0.406: v86.36,95.25 IC2.13 86.36,83.82 90.17,80.01 90.17,76.83 92.71,74.3 92.71,39.37 91.44,38.1 91.44,36.83 90.17,35.56 v83.19,35.56
  Bottom 0.406: UC6.23 148.59,96.52 147.32,97.79 133.35,97.79 132.08,96.52 UC7.23 113.03,96.52 111.76,95.25 v86.36,95.25 85.09,96.52 UC5.23 | IC2.13 IC2.12 | UD2.16 50.16,36.2 50.8,35.56 v83.19,35.56
!SRQ_IN  (via drill 0.6)
  Top 0.406: J2.3 59.69,154.31 60.96,153.03 v71.75,153.03 | UC6.18 132.72,96.52 v131.44,97.79 | v92.71,97.79 90.17,100.33 90.17,134.62 75.56,149.22 v71.75,149.22 | J1.10 304.17,144.78 v303.53,144.15
  Bottom 0.406: UC6.18 147.32,96.52 148.59,95.25 173.99,95.25 177.8,99.06 177.8,106.68 184.78,113.67 184.78,120.65 187.32,123.19 207.65,123.19 220.34,135.89 267.97,135.89 276.23,144.15 v303.53,144.15 | v71.75,149.22 v71.75,153.03 | v131.44,97.79 v92.71,97.79
!TV_READ  (via drill 0.6)
  Top 0.406: v181.61,8.26 UE7.1
  Bottom 0.406: UE8.1 209.55,36.2 208.28,34.92 205.1,34.92 203.84,36.2 UE7.1 | IC10.8 158.12,12.06 161.93,8.26 v181.61,8.26
#1_CASS_MOTOR  (via drill 0.6)
  Top 0.406: 121.28,167 J3.3
  Top 0.813: v120.65,166.37 121.28,167 | Q4.3 193.68,162.56 193.04,163.19 v193.04,173.99
  Bottom 0.813: J3.C v120.65,166.37 120.65,165.74 120.02,165.1 120.02,160.02 121.28,158.75 142.24,158.75 146.69,163.19 146.69,171.45 149.22,173.99 v193.04,173.99
#1_CASS_READ  (via drill 0.6)
  Top 0.406: UC7.40 116.2,143.51 119.38,146.69 119.38,155.57 118.75,156.21 v117.47,156.21 | v117.47,166.37 116.84,167 J3.4 | J2.8 40.01,147.96 41.91,146.05 R101.2
  Bottom 0.406: R101.2 67.31,150.5 71.12,154.31 94.61,154.31 95.89,155.57 116.84,155.57 v117.47,156.21 v117.47,166.37 J3.D
#1_CASS_SWITCH  (via drill 0.6)
  Top 0.406: UC7.6 102.87,127 104.14,128.27 104.14,140.97 99.06,146.05 v99.06,158.12 | v109.22,166.37 J3.6
  Bottom 0.406: J3.F 109.86,167 v109.22,166.37 109.22,160.66 106.68,158.12 v99.06,158.12
#2_CASS_READ  (via drill 0.6)
  Top 0.406: v47.62,147.32 J2.6 | v47.62,97.79 v47.62,128.27 v47.62,139.7 | R100.2 33.02,124.46 34.29,125.73 37.47,125.73 v40.01,128.27
  Bottom 0.406: v47.62,139.7 v47.62,147.32 | v47.62,128.27 v40.01,128.27 | v47.62,97.79 61.59,97.79 62.87,96.52 UC5.18
#2_CASS_SWITCH
  Bottom 0.406: UC7.7 99.06,124.46 97.79,123.19 SP2.1
+5V  (via drill 0.8, 1)
  Top 0.406: UG8.4 327.66,19.68 328.3,20.32 328.3,24.13 327.66,24.77 UG8.2 UG8.1 | UG6.11 UG6.10 287.65,114.94 288.29,114.3 288.29,110.49 287.65,109.86 UG6.8 286.38,108.58 285.75,107.95 274.95,107.95 274.32,107.31 | C31.1 153.03,72.39 154.31,73.66 JP2.1 | C77.1 SJ4.1
  Top 0.813: 97.79,160.02 RN1.1
  Top 1.27: R100.1 R13.2 R52.2 R17.2 R50.2 R14.2 17.78,137.16 | 17.78,137.16 IC1.14 | J3.2 v125.09,166.37 125.09,160.02 | v40.64,24.13 v40.64,56.52 | C80.1 5.71,46.35 5.08,45.72 | UA8.16 164.47,118.11 166.37,116.2 C52.1 174.62,115.57 183.51,106.68 v183.51,97.79 | v205.74,118.75 191.77,132.72 UA9.16 C56.1 | R16.2 UA2.8 | 17.78,137.16 C77.1 | 66.04,88.27 UC5.20 | UA7.16 164.47,91.54 C93.1 | JP5.1 67.06,87.25 66.04,88.27 | C9.1 66.04,88.27 | IC2.14 83.82,83.19 81.28,80.64 81.28,75.56 C22.1 84.45,72.39 IC3.32 IC3.31 | UE11.16 307.34,32.38 C92.1 | v194.31,97.79 194.31,116.2 195.26,117.16 | 195.26,117.16 196.22,118.11 UH5.14 | UH9.5 333.38,89.53 332.11,88.27 332.11,78.74 C24.1 | UH11.5 362.58,89.53 361.31,88.27 361.31,79.38 C35.1 | C49.1 312.42,114.3 311.15,113.03 311.15,106.68 C10.1 | C37.1 194.94,117.47 195.26,117.16 | C34.1 IC4.28 114.94,72.39 113.67,73.66 v113.67,89.53 | UE8.20 207.01,32.38 203.84,29.21 C11.1 | UE7.20 174.62,36.2 176.53,34.29 v176.53,29.21 | C42.1 UF5.16 | v159.38,29.21 IC7.20
  Top 1.778: v92.71,156.21 96.52,160.02 97.79,160.02 125.09,160.02 146.05,160.02 151.13,165.1 UC9.16 | v5.08,24.13 5.08,45.72 C7.1 | v220.98,133.99 v220.98,167.64 | v274.32,102.87 274.32,107.31 v274.32,128.91 v274.32,133.99 | v235.59,133.99 v235.59,128.91
  Top 2.184: 381,141.6 381,142.24 373.38,149.86 364.49,149.86 363.86,150.5 V7805.OUT
  Top 2.54: v381,29.21 v381,76.83 v381,102.87 +5V1.1 381,141.6
  Bottom 0.406: R51.2 50.16,14.61 47.62,17.14 C6.1 | UA2.4 36.2,9.53 38.73,12.06 38.73,14.61 41.27,17.14 UA2.8 | R29.1 107.31,88.9 106.68,89.53 | UA10.14 256.54,168.91 | 256.54,168.91 R30.2 | 256.54,168.91 260.35,168.91 261.62,170.18 R10.2 R48.2 | 326.39,29.21 UG8.1 | UG11.14 UG11.1 | UH3.2 263.52,122.56 266.06,125.09 UH3.14 | JP6.1 JP6.3 JP6.5 JP6.7 JP6.9 JP6.11 297.81,73.1 295.68,75.23 | UF10.32 UF10.31 | 318.77,29.21 R44.2 | R21.2 355.6,131.44 351.47,135.57
  Bottom 0.61: 47.62,24.13 R15.2
  Bottom 0.813: v92.71,156.21 R102.2 R101.1 | 27/SST.3 84.71,69.47 85.09,69.85 IC3.31 | 284.48,74.93 SJ1.3
  Bottom 1.27: 100.97,89.53 UC7.20 | R100.1 23.5,124.46 26.67,121.92 33.02,121.92 | J3.B 125.73,167 v125.09,166.37 | 135.89,89.53 UC6.20 | 104.14,29.21 UA4.14 | 82.55,29.21 UA3.14 | 123.83,29.21 UA5.14 | UD2.24 v40.64,56.52 38.73,58.42 29.84,58.42 C53.1 | UA10.14 250.19,170.81 C55.1 246.38,174.31 222.88,174.31 220.98,172.09 | 41.91,24.13 R16.2 | UA2.8 C6.1 | C7.1 UC3.20 | C1.1 101.75,89.39 101.6,89.53 | 80.64,88.27 C51.1 | C93.1 163.84,91.45 163.83,91.44 | 5.71,24.13 +5V.1 | JP5.1 JP1.1 | 147.96,29.21 IC10.14 | 172.09,29.21 UF6.16 | 214,29.21 UG1.14 | 236.85,29.21 UH2.14 | 258.44,29.21 257.81,28.57 UF1.14 | 314.96,29.21 UG9.14 | 334.01,29.21 UG8.14 | 353.06,29.21 UG10.14 | 372.11,29.21 UH8.14 | C31.1 IC9.28 | C41.1 UG3.20 | C39.1 UF4.14 | C45.1 UH3.14 | UG6.14 286.38,128.27 285.75,128.91 | 200.66,97.79 200.66,95.25 | 200.66,95.25 UG2.14 | C46.1 UG5.16 | C26.1 UF3.16 | 228.6,97.79 UF2.14 | IC5.24 237.49,67.31 238.76,68.58 C18.1 238.76,72.39 | C32.1 258.44,72.39 257.81,71.75 UF9.20 | 201.29,72.39 200.66,71.75 | 314.96,76.83 UH7.14 | C10.1 UH6.14 | C13.1 UG11.14 | IC6.14 316.23,121.28 313.69,118.75 C49.1 | 201.29,97.79 | C19.1 200.74,95.17 200.66,95.25 | 288.29,74.93 UF10.32 | 160.66,29.21 R40.2 | 150.81,29.21 C38.1 | C80.1 UI1.14
  Bottom 1.778: 83.82,88.27 84.45,88.27 85.72,89.53 100.97,89.53 101.6,89.53 106.68,89.53 v113.67,89.53 C78.1 135.89,89.53 154.31,89.53 156.21,91.44 163.83,91.44 175.9,91.44 182.25,97.79 v183.51,97.79 v194.31,97.79 200.66,97.79 201.29,97.79 205.74,97.79 | 83.82,88.27 IC2.14 | 33.02,89.53 10.79,89.53 5.08,84.45 C7.1 | 34.29,88.27 33.02,89.53 | 83.82,88.27 80.64,88.27 C9.1 34.29,88.27 | UB3.20 35.56,81.92 C79.1 34.29,83.19 34.29,88.27 | 33.02,89.53 C8.1 33.02,121.92 | 33.02,121.92 R28.1 | 33.02,121.92 UC4.8 | 64.77,29.21 55.88,29.21 50.8,24.13 47.62,24.13 41.91,24.13 v40.64,24.13 5.71,24.13 v5.08,24.13 | 64.77,29.21 UB2.14 | 64.77,29.21 C2.1 82.55,29.21 C3.1 104.14,29.21 C4.1 123.83,29.21 C5.1 147.96,29.21 150.81,29.21 C28.1 v159.38,29.21 160.66,29.21 172.09,29.21 C23.1 v176.53,29.21 R46.2 C11.1 214,29.21 C25.1 236.85,29.21 C27.1 258.44,29.21 C21.1 C92.1 314.96,29.21 C29.1 318.77,29.21 326.39,29.21 334.01,29.21 C36.1 353.06,29.21 C50.1 372.11,29.21 C40.1 v381,29.21 | UC9.16 C54.1 152.4,172.09 220.98,172.09 v220.98,167.64 | 353.06,141.6 CR10.A | C33.1 UH10.14 | C33.1 C35.1 C13.1 v381,76.83 | C33.1 C24.1 R12.2 C91.1 314.96,76.83 297.81,76.83 295.68,75.23 295.27,74.93 C30.1 288.29,74.93 284.48,74.93 270.51,74.93 267.97,72.39 C32.1 238.76,72.39 201.29,72.39 C42.1 R27.2 C31.1 | v381,102.87 C10.1 C46.1 v274.32,102.87 C26.1 241.3,102.87 236.22,97.79 C12.1 228.6,97.79 205.74,97.79 | 285.75,128.91 C20.1 v274.32,128.91 C45.1 C39.1 v235.59,128.91 C41.1 | 205.74,97.79 v205.74,118.75 v220.98,133.99 v235.59,133.99 v274.32,133.99 349.88,133.99 351.47,135.57 353.06,137.16 353.06,141.6
  Bottom 1.778: 353.06,141.6 C14.+
  Bottom 2.184: V7805.OUT 363.86,150.5 361.31,147.96 CR10.A
+9V_UNREG  (via drill 0.6)
  Top 0.813: v236.85,158.12 236.85,152.4 248.28,140.34 277.5,140.34 v288.93,128.91
  Top 2.184: S1.5 372.24,142.88 370.84,144.15 364.49,144.15 358.77,149.22 V7805.IN
  Bottom 0.406: Q4.2 194.94,165.1 192.41,162.56 Q5.1 C70.1 184.15,164.47 184.15,167.64 185.42,168.91 R4.2 | 364.49,125.73 R20.2
  Bottom 0.813: Q4.2 200.66,165.1 207.65,158.12 v236.85,158.12 | 9V.1 344.81,128.91 v288.93,128.91
  Bottom 1.27: S1.2 372.11,131.44 366.39,125.73 364.49,125.73 9V.1 | CR10.C C17.+
  Bottom 2.184: V7805.IN 358.77,156.84 357.5,158.12 CR10.C
  Bottom 2.54: S1.5 S1.2
AB0
  Top 0.406: UC4.9 34.92,120.65 29.21,120.65 27.94,119.38 27.94,113.67 12.06,97.79 12.06,77.47 10.79,76.2 UC3.2
AB1
  Top 0.406: UC4.10 34.92,116.84 15.88,97.79 UC3.17
AB2
  Top 0.406: UC4.11 34.29,114.3 17.14,97.16 17.14,78.11 15.88,76.83 UC3.4
AB3
  Top 0.406: UC4.12 35.56,111.76 20.95,97.16 UC3.15
AB4
  Top 0.406: UC4.13 35.56,109.22 22.23,96.52 22.23,78.11 20.95,76.83 UC3.6
AB5
  Top 0.406: UC4.14 34.92,106.68 26.04,97.79 UC3.13
AB6
  Top 0.406: UC4.15 34.92,104.14 27.3,96.52 27.3,78.11 26.04,76.83 UC3.8
AB7
  Top 0.406: UC4.16 34.92,101.6 31.11,97.79 UC3.11
AB8
  Top 0.406: UC4.17 39.37,99.06 42.55,95.89 42.55,78.11 41.27,76.83 UB3.2
AB9  (via drill 0.6)
  Top 0.406: UC4.18 38.73,96.52 40.01,95.25 v40.01,80.01
  Bottom 0.406: v40.01,80.01 45.72,80.01 46.35,80.64 UB3.17
AB10  (via drill 0.6)
  Top 0.406: UC4.19 34.92,93.98 33.66,92.71 33.66,79.38 v36.83,76.2
  Bottom 0.406: v36.83,76.2 45.72,76.2 46.35,75.56 UB3.4
AB11  (via drill 0.6)
  Top 0.406: v36.2,83.82 UC4.20
  Bottom 0.406: v36.2,83.82 50.8,83.82 51.44,83.19 UB3.15
AB12
  Top 0.406: UC4.22 50.8,93.98 48.9,92.08 48.9,85.72 50.16,84.45 50.16,76.83 51.44,76.2 UB3.6
AB13
  Top 0.406: UC4.23 53.98,96.52 56.52,93.98 UB3.13
AB14
  Top 0.406: UC4.24 55.24,99.06 57.78,96.52 57.78,78.11 56.52,76.83 UB3.8
AB15
  Top 0.406: UC4.25 56.52,101.6 59.69,98.42 59.69,85.72 61.59,83.82 UB3.11
B02  (via drill 0.6)
  Top 0.406: UC7.25 118.75,101.6 123.19,97.16 123.19,86.36 | v40.01,123.19 19.68,123.19 18.41,124.46 18.41,126.36 17.78,127 IC1.10 | 123.19,86.36 R29.2 | 120.65,27.3 121.28,27.3 122.56,26.04 128.27,26.04 v129.54,27.3 | 123.19,86.36 123.19,32.38 120.65,29.84 120.65,27.3 | 120.65,27.3 UA5.1 | v113.03,15.88 118.11,15.88 120.65,18.41 120.65,27.3
  Bottom 0.406: UC6.25 148.59,101.6 147.32,102.87 134.62,102.87 133.35,101.6 UC7.25 108.58,101.6 107.31,102.87 97.79,102.87 96.52,101.6 UC5.25 75.56,101.6 71.75,97.79 63.5,97.79 58.42,102.87 41.91,102.87 40.01,104.78 v40.01,123.19 | UA4.5 99.06,17.14 100.33,15.88 v113.03,15.88 | v129.54,27.3 IC10.1
B02A
  Top 0.406: UH3.3 259.08,120.02 257.81,118.75 257.81,111.76 258.44,111.12 262.25,111.12 262.89,110.49 262.89,78.74 261.62,77.47 261.62,49.53 260.35,48.26 255.91,48.26 253.37,45.72 248.92,45.72 230.5,27.3 UH2.1
B02B  (via drill 0.6)
  Top 0.406: UH3.4 263.52,117.47 264.16,116.84 264.16,106.68 265.43,105.41 v265.43,27.3
  Bottom 0.406: v265.43,27.3 UG9.1
B02F  (via drill 0.6)
  Top 0.406: UH3.11 267.33,117.47 266.7,116.84 266.7,107.95 267.97,106.68 v267.97,26.04 | v240.03,27.3 238.76,28.57 235.59,28.57 233.04,26.04 227.97,26.04 227.33,25.4 227.33,22.86 227.97,22.23 UH2.3
  Bottom 0.406: v267.97,26.04 248.28,26.04 247.01,27.3 v240.03,27.3
B02H  (via drill 0.6)
  Top 0.406: UH3.13 267.33,122.56 265.43,120.65 265.43,107.31 266.7,106.05 v266.7,18.41
  Bottom 0.406: UG1.9 220.34,14.61 224.16,18.41 v266.7,18.41 328.3,18.41 332.11,22.23 332.11,24.13 332.74,24.77 UG8.13
B_R/W  (via drill 0.6)
  Top 0.406: IC1.8 15.88,116.2 9.53,109.86 9.53,71.12 v10.79,69.85 | UA3.13 81.28,24.77 80.64,25.4 80.64,29.84 81.28,30.48 v81.28,71.12 | v159.38,70.48 JP2.3 | IC10.9 146.05,14.61 145.41,13.97 v145.41,9.53 | v113.03,9.53 110.49,12.06 v110.49,17.14 v110.49,68.58
  Bottom 0.406: IC1.8 R28.2 | v159.38,70.48 146.69,70.48 146.05,71.12 141.6,71.12 139.06,68.58 120.02,68.58 118.75,69.85 IC4.27 114.3,69.85 113.03,68.58 v110.49,68.58 99.69,68.58 97.16,71.12 v81.28,71.12 68.58,71.12 67.31,69.85 v10.79,69.85 | v113.03,9.53 v145.41,9.53 | v110.49,17.14 UA5.5
BA0  (via drill 0.6)
  Top 0.406: v20.95,50.16 12.06,59.05 12.06,75.56 13.34,76.83 UC3.18 13.34,97.16 34.29,118.11 39.37,118.11 41.27,120.02 v41.27,125.73 | IC9.10 131.44,49.53 132.08,48.9 132.08,27.94 128.91,24.77 v128.91,12.06 | v168.28,10.79 168.28,17.78 170.18,19.68 UF6.13
  Bottom 0.406: UC6.36 148.59,129.54 147.32,130.81 133.99,130.81 132.72,129.54 UC7.36 114.3,129.54 113.03,130.81 86.36,130.81 82.55,134.62 UC5.38 80.64,134.62 69.22,123.19 61.59,123.19 59.05,125.73 v41.27,125.73 | IC9.10 120.02,49.53 118.75,50.8 114.94,50.8 113.67,49.53 IC4.10 96.52,49.53 92.71,45.72 85.09,45.72 83.82,44.45 IC3.12 68.58,44.45 62.87,50.16 v20.95,50.16 | v128.91,12.06 137.16,12.06 138.43,13.34 160.66,13.34 163.19,10.79 v168.28,10.79
BA1  (via drill 0.6)
  Top 0.406: UC3.3 13.34,60.33 v20.95,52.7 | v133.35,39.37 133.35,51.44 132.72,52.07 IC9.9 125.73,52.07 124.46,53.34 v124.46,127 | v149.22,40.64 154.31,35.56 154.31,24.77 156.84,22.23 UF6.3
  Bottom 0.406: UC6.35 148.59,127 147.32,128.27 134.62,128.27 133.35,127 v124.46,127 UC7.35 114.3,127 113.03,128.27 87,128.27 83.19,132.08 UC5.37 | IC9.9 120.65,52.07 119.38,53.34 114.94,53.34 113.67,52.07 IC4.9 95.89,52.07 92.08,48.26 85.09,48.26 83.82,46.99 IC3.11 68.58,46.99 62.87,52.7 v20.95,52.7 | v133.35,39.37 140.97,39.37 142.24,40.64 v149.22,40.64
BA2  (via drill 0.6)
  Top 0.406: v22.23,55.24 17.14,60.33 17.14,76.2 18.41,77.47 UC3.16 18.41,96.52 34.92,113.03 38.1,113.03 42.55,117.47 v42.55,123.19
  Bottom 0.406: UC5.36 80.64,129.54 71.75,120.65 62.87,120.65 60.33,123.19 v42.55,123.19 | UF5.10 197.49,52.07 196.22,50.8 191.77,50.8 191.13,51.44 191.13,53.34 184.15,60.33 151.76,60.33 147.32,55.88 142.88,55.88 141.6,54.61 IC9.8 120.65,54.61 119.38,55.88 114.94,55.88 113.67,54.61 IC4.8 95.89,54.61 92.08,50.8 83.82,50.8 82.55,49.53 IC3.10 69.22,49.53 63.5,55.24 v22.23,55.24
BA3  (via drill 0.6)
  Top 0.406: UC3.5 18.41,64.14 v22.23,60.33 | UC5.35 83.19,127 83.82,126.36 83.82,93.34 83.19,92.71 79.38,92.71 78.74,92.08 78.74,73.66 80.01,72.39 v80.01,52.07
  Bottom 0.406: v22.23,60.33 40.64,60.33 42.55,58.42 48.26,58.42 49.53,57.15 64.14,57.15 69.22,52.07 IC3.9 v80.01,52.07 83.19,52.07 84.45,53.34 92.08,53.34 95.89,57.15 IC4.7 113.67,57.15 114.94,58.42 118.75,58.42 120.02,57.15 IC9.7 141.6,57.15 142.88,58.42 147.96,58.42 151.13,61.59 184.78,61.59 191.77,54.61 UF5.6
BA4  (via drill 0.6)
  Top 0.406: UC3.14 23.5,77.47 22.23,76.2 22.23,62.87 v23.5,61.59 | v125.73,99.06 125.73,61.59 127.64,59.69 IC9.6
  Bottom 0.406: v23.5,61.59 41.91,61.59 43.18,60.33 49.53,60.33 50.16,59.69 64.14,59.69 69.22,54.61 IC3.8 83.19,54.61 84.45,55.88 92.08,55.88 95.89,59.69 IC4.6 113.03,59.69 114.3,60.96 118.75,60.96 120.02,59.69 IC9.6 140.97,59.69 142.24,60.96 147.96,60.96 149.86,62.87 187.32,62.87 191.77,58.42 198.12,58.42 199.39,59.69 UF5.13 | v125.73,99.06 UC7.24
BA5  (via drill 0.6)
  Top 0.406: UC3.7 23.5,64.14 v24.77,62.87 | v127,99.06 127,62.87 127.64,62.23 IC9.5
  Bottom 0.406: v24.77,62.87 50.8,62.87 51.44,62.23 64.14,62.23 69.22,57.15 IC3.7 83.19,57.15 84.45,58.42 91.44,58.42 95.25,62.23 IC4.5 113.03,62.23 114.3,63.5 118.75,63.5 120.02,62.23 IC9.5 140.34,62.23 141.6,63.5 147.32,63.5 149.22,65.41 187.32,65.41 190.5,62.23 UF5.3 | UC6.24 148.59,99.06 147.32,100.33 128.27,100.33 v127,99.06
BA6  (via drill 0.6)
  Top 0.406: UC3.12 28.57,77.47 27.3,76.2 27.3,66.04 v27.94,65.41 | UA4.13 102.23,24.77 100.97,23.5 94.61,23.5 93.98,24.13 93.98,30.48 97.16,33.66 98.42,34.92 98.42,46.99 99.69,48.26 104.14,48.26 106.05,50.16 v106.05,64.77 | v227.33,69.85 245.75,88.27 245.75,90.17 247.65,92.08 UF3.3
  Bottom 0.406: v27.94,65.41 52.07,65.41 52.7,64.77 64.14,64.77 69.22,59.69 IC3.6 81.92,59.69 83.19,60.96 91.44,60.96 95.25,64.77 IC4.4 v106.05,64.77 113.03,64.77 114.3,66.04 118.75,66.04 120.02,64.77 IC9.4 140.34,64.77 141.6,66.04 146.69,66.04 149.22,67.94 160.66,67.94 161.93,69.22 226.69,69.22 v227.33,69.85
BA7  (via drill 0.6)
  Top 0.406: UC3.9 28.57,67.94 v29.21,67.31 | v219.07,70.48 226.06,70.48 244.47,88.9 244.47,90.81 247.01,93.34 252.09,93.34 255.91,89.53 UF3.13
  Bottom 0.406: v219.07,70.48 161.29,70.48 160.02,69.22 148.59,69.22 147.96,68.58 141.6,68.58 140.34,67.31 IC9.3 120.02,67.31 118.75,68.58 114.3,68.58 113.03,67.31 IC4.3 95.25,67.31 91.44,63.5 74.93,63.5 73.66,62.23 IC3.5 69.22,62.23 64.14,67.31 v29.21,67.31
BA8  (via drill 0.6)
  Top 0.406: UB3.18 43.81,77.47 42.55,76.2 v42.55,64.14 | UB2.1 57.78,49.53 60.33,52.07 v60.33,63.5 | v217.81,66.04 220.34,63.5 226.69,63.5 247.65,84.45 UF3.6
  Bottom 0.406: v42.55,64.14 51.44,64.14 52.07,63.5 v60.33,63.5 64.14,63.5 69.22,58.42 82.55,58.42 83.82,59.69 IC3.27 91.44,59.69 95.25,63.5 113.03,63.5 114.3,64.77 IC4.25 118.75,64.77 120.02,63.5 140.34,63.5 141.6,64.77 IC9.25 147.32,64.77 149.22,66.67 187.32,66.67 190.5,63.5 196.85,63.5 199.39,66.04 202.56,66.04 203.2,66.67 217.17,66.67 v217.81,66.04
BA9  (via drill 0.6)
  Top 0.406: UB3.3 v43.81,61.59 43.81,60.33 42.55,59.05 42.55,29.21 46.99,24.77 UB2.2 | v215.9,65.41 220.34,60.96 226.06,60.96 248.28,83.19 254,83.19 255.27,81.92 UF3.10
  Bottom 0.406: v43.81,61.59 50.16,61.59 50.8,60.96 64.14,60.96 69.22,55.88 83.19,55.88 84.45,57.15 IC3.26 92.08,57.15 95.89,60.96 113.03,60.96 114.3,62.23 IC4.24 118.75,62.23 120.02,60.96 140.34,60.96 141.6,62.23 IC9.24 147.32,62.23 149.22,64.14 187.32,64.14 190.5,60.96 196.22,60.96 198.75,63.5 201.93,63.5 203.84,65.41 v215.9,65.41
BA10  (via drill 0.6)
  Top 0.406: UB3.16 48.9,78.74 47.62,77.47 47.62,61.59 44.45,58.42 44.45,52.7 | UB2.4 59.69,19.68 60.33,20.32 60.33,24.77 59.05,26.04 47.62,26.04 44.45,29.21 44.45,52.7 | v52.07,53.98 52.07,53.34 51.44,52.7 44.45,52.7 | v147.96,54.61 147.96,40.01 153.03,34.92 153.03,24.13 154.94,22.23 v154.94,14.61
  Bottom 0.406: v52.07,53.98 63.5,53.98 69.22,48.26 83.19,48.26 84.45,49.53 IC3.23 92.08,49.53 95.89,53.34 113.67,53.34 114.94,54.61 IC4.21 119.38,54.61 120.65,53.34 141.6,53.34 142.88,54.61 IC9.21 v147.96,54.61 | UF6.10 170.81,12.06 169.54,13.34 162.56,13.34 161.29,14.61 v154.94,14.61
BA11  (via drill 0.6)
  Top 0.406: v50.16,58.42 50.16,60.33 48.9,61.59 UB3.5 | UA3.3 76.83,22.23 77.47,22.86 v77.47,53.34 | v135.89,58.42 135.89,23.5 137.79,21.59 137.79,20.32 138.43,19.68 IC10.4
  Bottom 0.406: IC9.23 142.24,59.69 140.97,58.42 v135.89,58.42 120.02,58.42 118.75,59.69 IC4.23 114.3,59.69 113.03,58.42 95.89,58.42 92.08,54.61 IC3.25 84.45,54.61 83.19,53.34 v77.47,53.34 69.22,53.34 64.14,58.42 v50.16,58.42
BA12  (via drill 0.6)
  Top 0.406: UB3.14 53.98,80.01 52.7,78.74 v52.7,68.58 52.7,57.15 49.53,53.98 UD2.23 | v67.31,73.66 67.31,67.31 69.85,64.77 IC3.4
  Bottom 0.406: IC9.2 120.02,69.85 118.75,71.12 114.3,71.12 113.03,69.85 IC4.2 99.69,69.85 95.89,73.66 v67.31,73.66 | v52.7,68.58 64.14,68.58 67.94,64.77 IC3.4
BA13  (via drill 0.6)
  Top 0.406: UB3.7 v53.98,66.04 53.98,52.7 52.7,51.44 UD2.22
  Bottom 0.406: IC9.26 141.6,67.31 140.34,66.04 120.02,66.04 118.75,67.31 IC4.26 114.3,67.31 113.03,66.04 95.25,66.04 91.44,62.23 IC3.28 75.56,62.23 74.3,60.96 69.22,60.96 64.14,66.04 v53.98,66.04
BA14  (via drill 0.6)
  Top 0.406: UB3.12 59.05,77.47 57.78,76.2 57.78,53.34 v55.88,51.44 53.34,48.9 UD2.21 | v82.55,45.72 v82.55,64.77 | v97.79,68.58 97.79,71.75 98.42,72.39 IC4.1
  Bottom 0.406: IC9.1 127.64,72.39 126.36,73.66 102.23,73.66 IC4.1 | v55.88,51.44 62.87,51.44 68.58,45.72 v82.55,45.72 | v82.55,64.77 IC3.29 90.81,64.77 95.25,68.58 v97.79,68.58
BA15  (via drill 0.6)
  Top 0.406: UB3.9 59.05,52.7 52.7,46.35 UD2.20 | v250.19,33.66 UF1.1 253.37,27.3 255.91,24.77 UF1.13 | v99.06,55.88 v99.06,50.8 | v83.82,41.27 83.82,42.55 84.45,43.18 89.53,43.18 90.81,44.45 v90.81,46.99 | IC4.22 114.94,57.15 112.39,54.61 v112.39,33.97 | UA4.2 UA4.1 98.42,27.3 103.5,33.66 103.82,33.97 v106.05,33.97
  Bottom 0.406: v250.19,33.66 158.75,33.66 158.43,33.34 117.79,33.34 117.16,33.97 v112.39,33.97 v106.05,33.97 | v99.06,55.88 113.67,55.88 114.94,57.15 IC4.22 | UD2.20 48.9,46.35 54.61,40.64 83.19,40.64 v83.82,41.27 | v99.06,50.8 95.89,50.8 92.08,46.99 v90.81,46.99
BD0  (via drill 0.6)
  Top 0.406: v203.84,39.05 206.38,41.27 UE8.18 UE8.17
  Bottom 0.406: IC7.18 162.56,41.27 163.83,40.01 182.88,40.01 183.83,39.05 v203.84,39.05
BD1  (via drill 0.6)
  Top 0.406: v204.47,41.27 204.47,44.45 206.38,46.35 UE8.16 UE8.15
  Bottom 0.406: IC7.17 162.56,43.81 163.83,42.55 182.88,42.55 184.15,41.27 v204.47,41.27
BD2  (via drill 0.6)
  Top 0.406: v202.56,43.81 204.47,45.72 204.47,50.8 205.1,51.44 UE8.14 UE8.13
  Bottom 0.406: IC7.16 162.56,46.35 163.83,45.09 177.16,45.09 179.71,47.62 182.88,47.62 186.69,43.81 v202.56,43.81
BD3  (via drill 0.6)
  Top 0.406: v203.2,46.35 203.2,55.24 204.47,56.52 UE8.12 UE8.11
  Bottom 0.406: IC7.15 162.56,48.9 163.83,47.62 176.53,47.62 179.07,50.16 184.78,50.16 188.59,46.35 v203.2,46.35
BD4  (via drill 0.6)
  Top 0.406: v177.16,50.16 177.16,45.72 175.26,43.81 UE7.17 UE7.18
  Bottom 0.406: IC7.14 162.56,51.44 163.83,50.16 v177.16,50.16
BD5  (via drill 0.6)
  Top 0.406: v175.9,52.7 175.9,49.53 175.26,48.9 UE7.15 UE7.16
  Bottom 0.406: IC7.13 162.56,53.98 163.83,52.7 v175.9,52.7
BD6
  Top 0.406: UE7.13 UE7.14
  Bottom 0.406: IC7.12 162.56,56.52 163.83,55.24 170.81,55.24 172.09,53.98 UE7.13
BD7
  Top 0.406: UE7.11 UE7.12
  Bottom 0.406: IC7.11 163.19,59.05 164.47,57.78 171.45,57.78 172.72,59.05 UE7.11
CA1
  Bottom 0.406: J2.B 63.5,156.21 64.14,155.57 64.14,144.78 | 64.14,144.78 64.14,139.06 64.77,138.3 78.11,138.3 79.38,139.7 UC5.40 | R102.1 68.58,144.78 64.14,144.78
CASS_WRITE  (via drill 0.6)